# Altium schematic sheet ADG714.SchDoc
size 635 x 241 mm
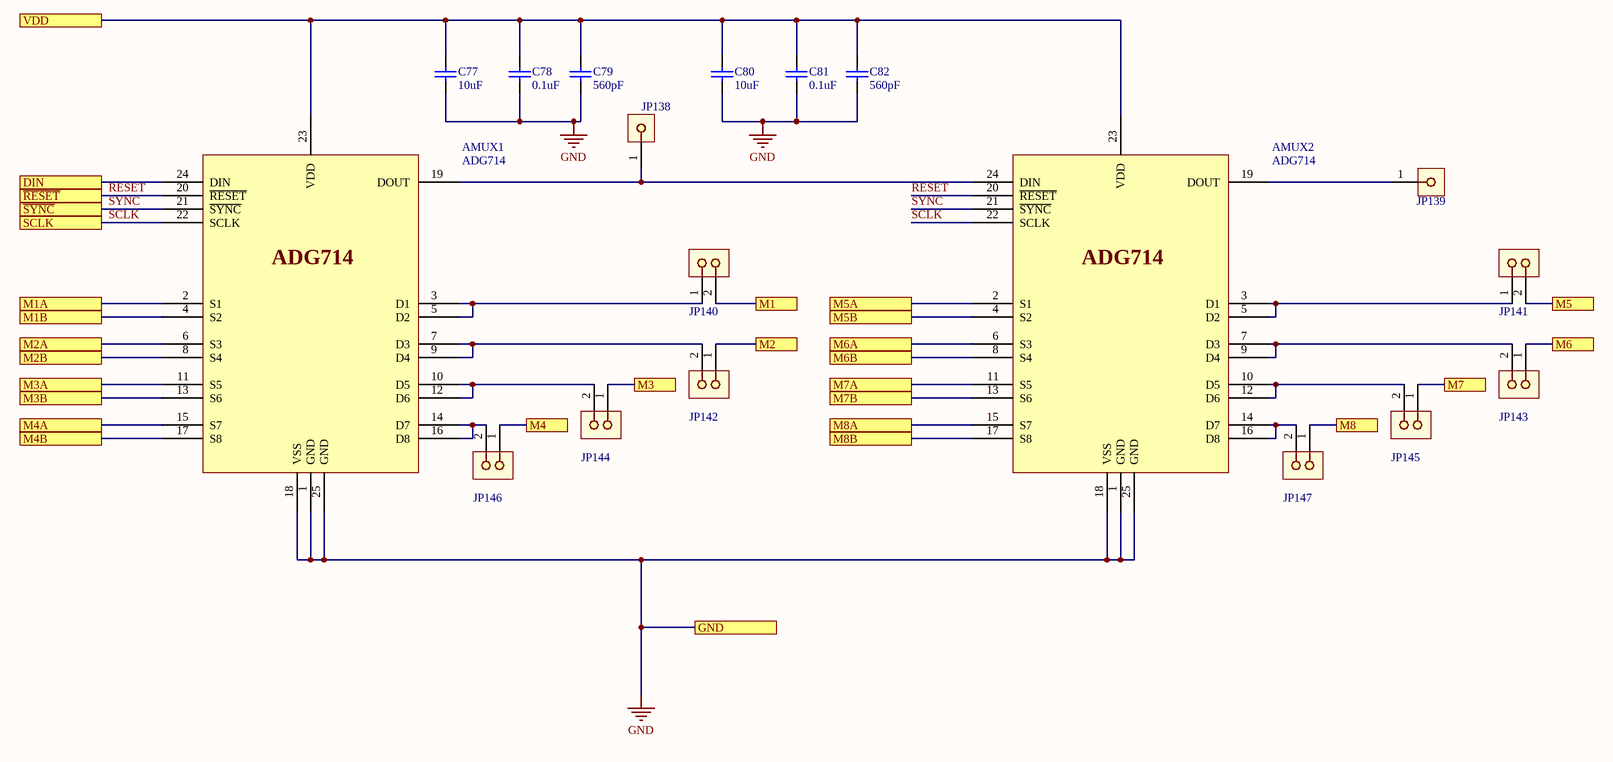
[diagram p0: ADG714.SchDoc]

## Parts
AMUX1  ADG714  [ADG714BCPZ]
AMUX2  ADG714  [ADG714BCPZ]
C77  10uF  [C0805]
C78  0.1uF  [C0805]
C79  560pF  [C0805]
C80  10uF  [C0805]
C81  0.1uF  [C0805]
C82  560pF  [C0805]
JP138  01x01  [01x01_0_0.1in_th_straight_b_nom]  (value not drawn)
JP139  01x01  [01x01_0_0.1in_th_straight_b_nom]  (value not drawn)
JP140  01x02  [01x02_0.1in_th_straight_b_nom]  (value not drawn)
JP141  01x02  [01x02_0.1in_th_straight_b_nom]  (value not drawn)
JP142  01x02  [01x02_0.1in_th_straight_b_nom]  (value not drawn)
JP143  01x02  [01x02_0.1in_th_straight_b_nom]  (value not drawn)
JP144  01x02  [01x02_0.1in_th_straight_b_nom]  (value not drawn)
JP145  01x02  [01x02_0.1in_th_straight_b_nom]  (value not drawn)
JP146  01x02  [01x02_0.1in_th_straight_b_nom]  (value not drawn)
JP147  01x02  [01x02_0.1in_th_straight_b_nom]  (value not drawn)

## Ports
DIN, GND, M1, M1A, M1B, M2, M2A, M2B, M3, M3A, M3B, M4, M4A, M4B, M5, M5A, M5B, M6, M6A, M6B, M7, M7A, M7B, M8, M8A, M8B, SCLK, VDD, ~{RESET}, ~{SYNC}

## Nets
GND: AMUX1.1(GND) AMUX1.18(VSS) AMUX1.25(GND) AMUX2.1(GND) AMUX2.18(VSS) AMUX2.25(GND) C77.1 C78.1 C79.1 C80.1 C81.1 C82.1 ; port GND
DIN: AMUX1.24(DIN) ; port DIN
M1: JP140.2 ; port M1
M1A: AMUX1.2(S1) ; port M1A
M1B: AMUX1.4(S2) ; port M1B
M2: JP142.1 ; port M2
M2A: AMUX1.6(S3) ; port M2A
M2B: AMUX1.8(S4) ; port M2B
M3: JP144.1 ; port M3
M3A: AMUX1.11(S5) ; port M3A
M3B: AMUX1.13(S6) ; port M3B
M4: JP146.1 ; port M4
M4A: AMUX1.15(S7) ; port M4A
M4B: AMUX1.17(S8) ; port M4B
M5: JP141.2 ; port M5
M5A: AMUX2.2(S1) ; port M5A
M5B: AMUX2.4(S2) ; port M5B
M6: JP143.1 ; port M6
M6A: AMUX2.6(S3) ; port M6A
M6B: AMUX2.8(S4) ; port M6B
M7: JP145.1 ; port M7
M7A: AMUX2.11(S5) ; port M7A
M7B: AMUX2.13(S6) ; port M7B
M8: JP147.1 ; port M8
M8A: AMUX2.15(S7) ; port M8A
M8B: AMUX2.17(S8) ; port M8B
~{RESET}: AMUX1.20(~{RESET}) AMUX2.20(~{RESET}) ; port ~{RESET}
~{SYNC}: AMUX1.21(~{SYNC}) AMUX2.21(~{SYNC}) ; port ~{SYNC}
SCLK: AMUX1.22(SCLK) AMUX2.22(SCLK) ; port SCLK
VDD: AMUX1.23(VDD) AMUX2.23(VDD) C77.2 C78.2 C79.2 C80.2 C81.2 C82.2 ; port VDD
NetAMUX1_3: AMUX1.3(D1) AMUX1.5(D2) JP140.1
NetAMUX1_7: AMUX1.7(D3) AMUX1.9(D4) JP142.2
NetAMUX1_10: AMUX1.10(D5) AMUX1.12(D6) JP144.2
NetAMUX1_14: AMUX1.14(D7) AMUX1.16(D8) JP146.2
NetAMUX1_19: AMUX1.19(DOUT) AMUX2.24(DIN) JP138.1
NetAMUX2_3: AMUX2.3(D1) AMUX2.5(D2) JP141.1
NetAMUX2_7: AMUX2.7(D3) AMUX2.9(D4) JP143.2
NetAMUX2_10: AMUX2.10(D5) AMUX2.12(D6) JP145.2
NetAMUX2_14: AMUX2.14(D7) AMUX2.16(D8) JP147.2
NetAMUX2_19: AMUX2.19(DOUT) JP139.1

## Library data of the parts
AMUX1 AMUX2 = ADG714: Analog MUX
C77 C80 = Cap 10uF: Manufacturer: Taiyo Yuden; Manufacturer Part Number: UMK212SD103KD-T; Dielectric Material: Ceramic; Capacitance: 10nF; Tolerance: 10%; Voltage Rating: 50V; Supplier 1: Digi-Key; Stock 1: 14125; Pricing 1: 1=0.47, 10=0.323, 100=0.1941, 500=0.1455, 1000=0.1229 (USD); Mount: Surface Mount; Case/Package: 0805; Number of Pins: 2; Case Code (Metric): 2012; Case Code (Imperial): 0805; Min Operating Temperature: -55°C; Max Operating Temperature: 125°C; Packaging: Tape and Reel; Package Quantity: 1; Voltage Rating (DC): 50V; Termination: SMD/SMT; Length: 2mm; Height: 0.85mm; Width: 0.049inch; Thickness: 0.037inch; Depth: 1.25mm; Radiation Hardening: No; Lead Free: Lead Free; Halogen Free: Halogen Free; ComponentLink1URL: https://datasheet.ciiva.com/138/umk212sd103kd-t-ss-138661.pdf; ComponentLink1Description: https://datasheet.ciiva.com/138/umk212sd103kd-t-ss-138661.pdf; ComponentLink2URL: https://datasheet.ciiva.com/138/mlcc07-e-138662.pdf; ComponentLink2Description: https://datasheet.ciiva.com/138/mlcc07-e-138662.pdf; ComponentLink3URL: https://datasheet.ciiva.com/138/mlcc07-e-138663.pdf; ComponentLink3Description: https://datasheet.ciiva.com/138/mlcc07-e-138663.pdf; ComponentLink4URL: https://datasheet.ciiva.com/30140/303umk212sd103kd-t-30140925.pdf; ComponentLink4Description: https://datasheet.ciiva.com/30140/303umk212sd103kd-t-30140925.pdf; Supplier Part Number 1: 587-1114-1-ND
C78 C81 = Cap 0.1uF: Manufacturer: Taiyo Yuden; Manufacturer Part Number: UMK212SD103KD-T; Dielectric Material: Ceramic; Capacitance: 10nF; Tolerance: 10%; Voltage Rating: 50V; Supplier 1: Digi-Key; Stock 1: 14125; Pricing 1: 1=0.47, 10=0.323, 100=0.1941, 500=0.1455, 1000=0.1229 (USD); Mount: Surface Mount; Case/Package: 0805; Number of Pins: 2; Case Code (Metric): 2012; Case Code (Imperial): 0805; Min Operating Temperature: -55°C; Max Operating Temperature: 125°C; Packaging: Tape and Reel; Package Quantity: 1; Voltage Rating (DC): 50V; Termination: SMD/SMT; Length: 2mm; Height: 0.85mm; Width: 0.049inch; Thickness: 0.037inch; Depth: 1.25mm; Radiation Hardening: No; Lead Free: Lead Free; Halogen Free: Halogen Free; ComponentLink1URL: https://datasheet.ciiva.com/138/umk212sd103kd-t-ss-138661.pdf; ComponentLink1Description: https://datasheet.ciiva.com/138/umk212sd103kd-t-ss-138661.pdf; ComponentLink2URL: https://datasheet.ciiva.com/138/mlcc07-e-138662.pdf; ComponentLink2Description: https://datasheet.ciiva.com/138/mlcc07-e-138662.pdf; ComponentLink3URL: https://datasheet.ciiva.com/138/mlcc07-e-138663.pdf; ComponentLink3Description: https://datasheet.ciiva.com/138/mlcc07-e-138663.pdf; ComponentLink4URL: https://datasheet.ciiva.com/30140/303umk212sd103kd-t-30140925.pdf; ComponentLink4Description: https://datasheet.ciiva.com/30140/303umk212sd103kd-t-30140925.pdf; Supplier Part Number 1: 587-1114-1-ND
C79 C82 = Cap 560pF: Manufacturer: Taiyo Yuden; Manufacturer Part Number: UMK212SD103KD-T; Dielectric Material: Ceramic; Capacitance: 10nF; Tolerance: 10%; Voltage Rating: 50V; Stock 1: 14125; Pricing 1: 1=0.47, 10=0.323, 100=0.1941, 500=0.1455, 1000=0.1229 (USD); Mount: Surface Mount; Case/Package: 0805; Number of Pins: 2; Case Code (Metric): 2012; Case Code (Imperial): 0805; Min Operating Temperature: -55°C; Max Operating Temperature: 125°C; Packaging: Tape and Reel; Package Quantity: 1; Voltage Rating (DC): 50V; Termination: SMD/SMT; Length: 2mm; Height: 0.85mm; Width: 0.049inch; Thickness: 0.037inch; Depth: 1.25mm; Radiation Hardening: No; Lead Free: Lead Free; Halogen Free: Halogen Free; ComponentLink1URL: https://datasheet.ciiva.com/138/umk212sd103kd-t-ss-138661.pdf; ComponentLink1Description: https://datasheet.ciiva.com/138/umk212sd103kd-t-ss-138661.pdf; ComponentLink2URL: https://datasheet.ciiva.com/138/mlcc07-e-138662.pdf; ComponentLink2Description: https://datasheet.ciiva.com/138/mlcc07-e-138662.pdf; ComponentLink3URL: https://datasheet.ciiva.com/138/mlcc07-e-138663.pdf; ComponentLink3Description: https://datasheet.ciiva.com/138/mlcc07-e-138663.pdf; ComponentLink4URL: https://datasheet.ciiva.com/30140/303umk212sd103kd-t-30140925.pdf; ComponentLink4Description: https://datasheet.ciiva.com/30140/303umk212sd103kd-t-30140925.pdf; Supplier 1: Digi-Key; Supplier Part Number 1: 311-1120-1-ND
JP138 JP139 = 01x01: 01X01 generic terminal connector
JP140-JP147 = 01x02: 01X02 generic terminal connector